# Altium schematic sheet PWM.SchDoc
size A2
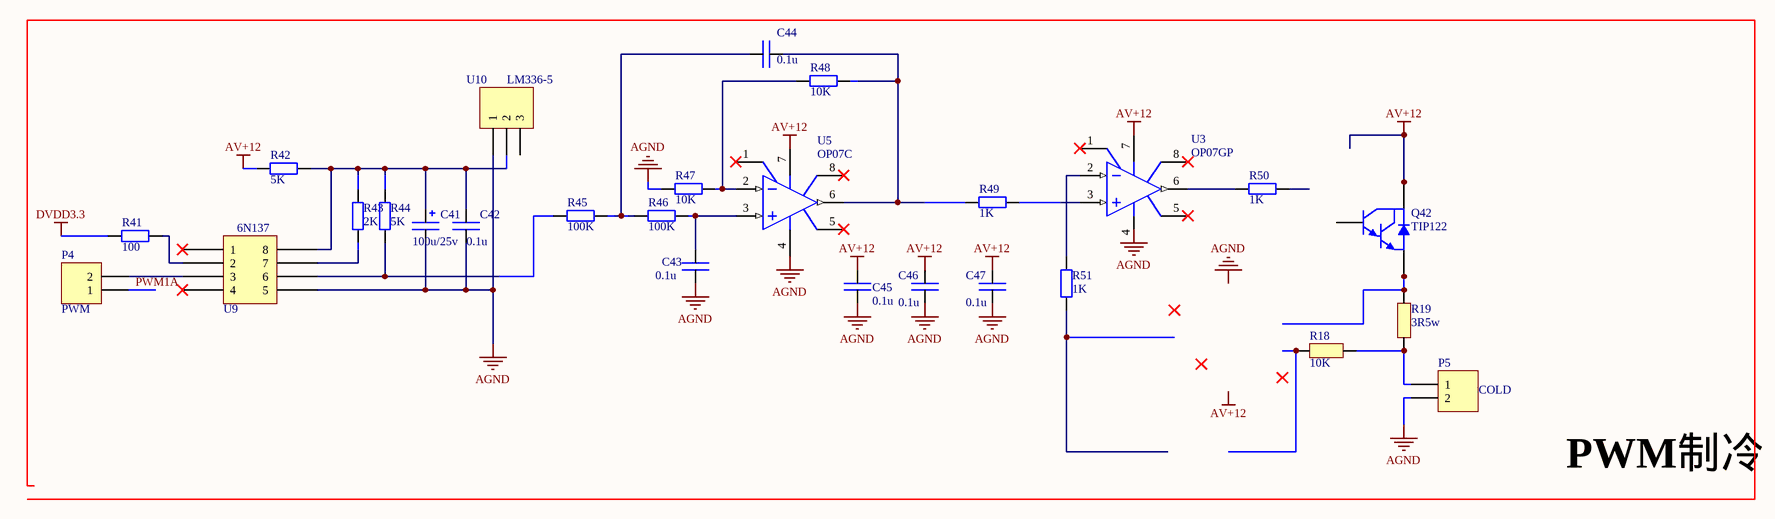
[diagram p0: PWM.SchDoc]

## Parts
C41  100u/25v  [电解电容100uF/25V]
C42  0.1u  [0805]
C43  0.1u  [0805]
C44  0.1u  [0805]
C45  0.1u  [0805]
C46  0.1u  [0805]
C47  0.1u  [0805]
P4  PWM  [HDR1X2]
P5  COLD  [HDR1X2]
Q42  TIP122  [TIP122]
R18  10K  [0805]
R19  3R5w  [big_ris]
R41  value 100  [AXIAL-0.4]  (hidden comment: Res2)
R42  value 5K  [AXIAL-0.4]  (hidden comment: Res2)
R43  value 2K  [AXIAL-0.4]  (hidden comment: Res2)
R44  value 5K  [AXIAL-0.4]  (hidden comment: Res2)
R45  value 100K  [AXIAL-0.4]  (hidden comment: Res2)
R46  value 100K  [AXIAL-0.4]  (hidden comment: Res2)
R47  value 10K  [AXIAL-0.4]  (hidden comment: Res2)
R48  value 10K  [AXIAL-0.4]  (hidden comment: Res2)
R49  value 1K  [AXIAL-0.4]  (hidden comment: Res2)
R50  value 1K  [AXIAL-0.4]  (hidden comment: Res2)
R51  value 1K  [AXIAL-0.4]  (hidden comment: Res2)
U3  OP07GP  [SO-8-N]
U5  OP07C  [SO-8-N]
U9  6N137  [SO-G8]  (value not drawn)
U10  LM336-5  [TO-92]

## Nets
AGND: C41.2 C42.2 C43.1 C45.1 C46.1 C47.1 P5.2 R47.1 U5.4(V-) U9.5 U10.1
AV+12: C45.2 C46.2 C47.2 Q42.2(C) R42.2 U3.7(V+) U5.7(V+)
DVDD3.3: R41.2
PWM1A: P4.1
NetC41_1: C41.1 C42.1 R42.1 R43.1 R44.1 U9.8 U10.2
NetC43_2: C43.2 R46.2 U5.3(IN+)
NetC44_1: C44.1 R45.2 R46.1
NetC44_2: C44.2 R48.2 R49.1 U5.6(OUT)
NetP4_2: P4.2 U9.3
NetP5_1: P5.1 R18.2 R19.1
NetQ42_3: Q42.3(E) R19.2
NetR41_1: R41.1 U9.2
NetR43_2: R43.2 U9.7
NetR44_2: R44.2 R45.1 U9.6
NetR47_2: R47.2 R48.1 U5.2(IN-)
NetR49_2: R49.2 U3.3(IN+)
NetR50_1: R50.1 U3.6(OUT)
NetR51_2: R51.2 U3.2(IN-)

Not connected (* = marked no-connect by the designer): Q42 1(B); R18 1; R50 2; R51 1; U3 1(VOSTRIM)* 4(V-) 5(NC)* 8(VOSTRIM)*; U5 1(VOSTRIM)* 5(NC)* 8(VOSTRIM)*; U9 1* 4*; U10 3

## Notes on the sheet
- PWM制冷
- Labels drawn without touching a wire or pin: AGND, AV+12

## Library data of the parts
C41 = Cap Pol
C42-C47 = Cap
P4 P5 = Header 2: Header, 2-Pin; LatestRevisionDate: 17-Jul-2002; LatestRevisionNote: Re-released for DXP Platform.; Publisher: Altium Limited
Q42 = NPN2: NPN Darlington Bipolar Transistor; Published: 8-Jun-2000; LatestRevisionDate: 17-Jul-2002; LatestRevisionNote: Re-released for DXP Platform.; PackageReference: TO-226; Publisher: Altium Limited; Code_JEDEC: TO-226-AE
R18 R19 = Res
R41-R51 = Res2: Resistor; Published: 8-Jun-2000; LatestRevisionDate: 17-Jul-2002; LatestRevisionNote: Re-released for DXP Platform.; PackageReference: AXIAL-0.4; Publisher: Altium Limited
U3 U5 = OP37GP: Note: Pin 5 is not connected.; Published: 8-Jun-2000; LatestRevisionDate: 04-Mar-2005; LatestRevisionNote: Stylized 3D Model Added.; DatasheetVersion: 1992; PackageReference: N-8_A; Publisher: Altium Limited; PackageDescription: DIP; 8 Leads; Row Spacing 7.62 mm; Pitch 2.54 mm; Code_JEDEC: MO-001-AN; ComponentLink1Description: Manufacturer Link; ComponentLink1URL: http://www.analog.com/en/prod/0,,759_786_OP37%2C00.html; ComponentLink2Description: Datasheet; ComponentLink2URL: http://www.analog.com/UploadedFiles/Data_Sheets/5021673OP37_b.pdf
U10 = Header 3: Header, 3-Pin; LatestRevisionDate: 17-Jul-2002; LatestRevisionNote: Re-released for DXP Platform.; Publisher: Altium Limited